# Altium schematic sheet Startracker_Power.SchDoc
size A3; SheetNumber: 2; SheetTotal: 3
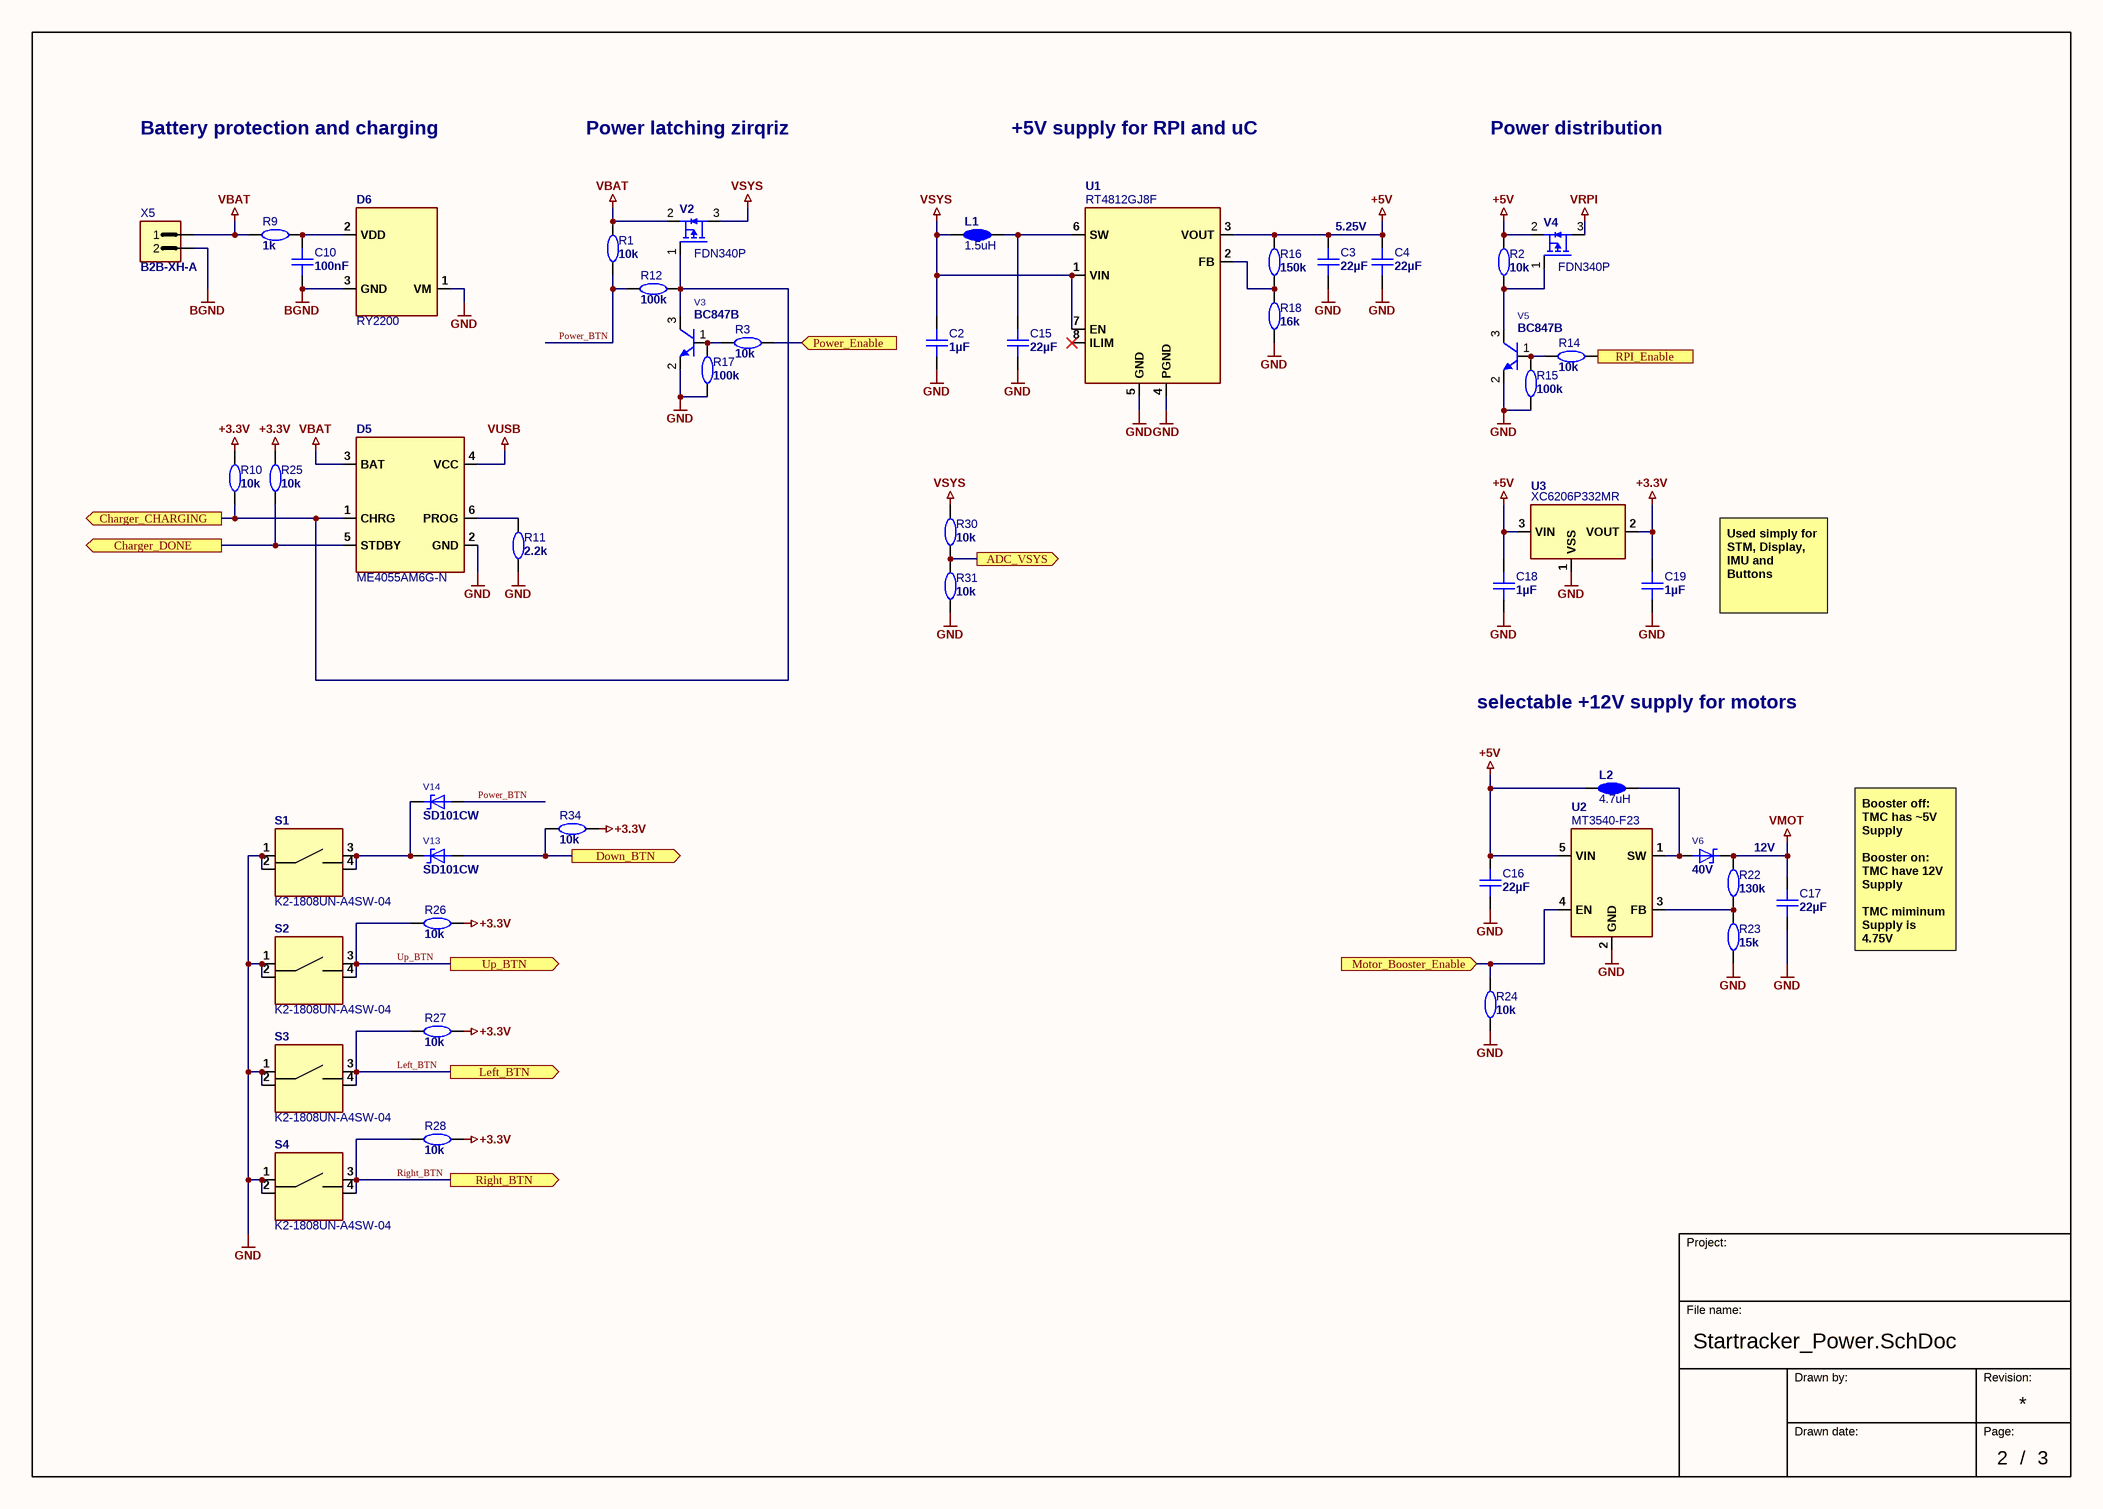
[diagram p0: Startracker_Power.SchDoc]

## Parts
C2  value 1µF  [C-0603_1608_095_L_RF]  (hidden comment: Cap 1u 0603)
C3  value 22µF  [C-1206_3216_230_L_RF]  (hidden comment: Cap 22u 25V 10% 1206)
C4  value 22µF  [C-1206_3216_230_L_RF]  (hidden comment: Cap 22u 25V 10% 1206)
C10  value 100nF  [C-0603_1608_095_L_RF]  (hidden comment: Cap 100n 0603)
C15  value 22µF  [C-1206_3216_230_L_RF]  (hidden comment: Cap 22u 25V 10% 1206)
C16  value 22µF  [C-1206_3216_230_L_RF]  (hidden comment: Cap 22u 25V 10% 1206)
C17  value 22µF  [C-1206_3216_230_L_RF]  (hidden comment: Cap 22u 25V 10% 1206)
C18  value 1µF  [C-0603_1608_095_L_RF]  (hidden comment: Cap 1u 0603)
C19  value 1µF  [C-0603_1608_095_L_RF]  (hidden comment: Cap 1u 0603)
D5  ME4055AM6G-N  [SOT23-6_N_RF]
D6  RY2200  [SOT23_N_RF]
L1  1.5uH  [L-0490X0490_N_RF]
L2  4.7uH  [L-0400X0400_N_RF]
R1  value 10k  [R-0603_1608_050_L_RF]  (hidden comment: Res 10k 0603)
R2  value 10k  [R-0603_1608_050_L_RF]  (hidden comment: Res 10k 0603)
R3  value 10k  [R-0603_1608_050_L_RF]  (hidden comment: Res 10k 0603)
R9  value 1k  [R-0603_1608_050_L_RF]  (hidden comment: Res 1k 0603)
R10  value 10k  [R-0603_1608_050_L_RF]  (hidden comment: Res 10k 0603)
R11  value 2.2k  [R-0603_1608_050_L_RF]  (hidden comment: Res 2k2 0603)
R12  value 100k  [R-0603_1608_050_L_RF]  (hidden comment: Res 100k 0603)
R14  value 10k  [R-0603_1608_050_L_RF]  (hidden comment: Res 10k 0603)
R15  value 100k  [R-0603_1608_050_L_RF]  (hidden comment: Res 100k 0603)
R16  value 150k  [R-0603_1608_050_L_RF]  (hidden comment: Res 150k 0603)
R17  value 100k  [R-0603_1608_050_L_RF]  (hidden comment: Res 100k 0603)
R18  value 16k  [R-0603_1608_050_L_RF]  (hidden comment: Res 16k 0603)
R22  value 130k  [R-0603_1608_050_L_RF]  (hidden comment: Res 130k 0603)
R23  value 15k  [R-0603_1608_050_L_RF]  (hidden comment: Res 15k 0603)
R24  value 10k  [R-0603_1608_050_L_RF]  (hidden comment: Res 10k 0603)
R25  value 10k  [R-0603_1608_050_L_RF]  (hidden comment: Res 10k 0603)
R26  value 10k  [R-0603_1608_050_L_RF]  (hidden comment: Res 10k 0603)
R27  value 10k  [R-0603_1608_050_L_RF]  (hidden comment: Res 10k 0603)
R28  value 10k  [R-0603_1608_050_L_RF]  (hidden comment: Res 10k 0603)
R30  value 10k  [R-0603_1608_050_L_RF]  (hidden comment: Res 10k 0603)
R31  value 10k  [R-0603_1608_050_L_RF]  (hidden comment: Res 10k 0603)
R34  value 10k  [R-0603_1608_050_L_RF]  (hidden comment: Res 10k 0603)
S1  K2-1808UN-A4SW-04  [K2-1808UN-A4SW-04]
S2  K2-1808UN-A4SW-04  [K2-1808UN-A4SW-04]
S3  K2-1808UN-A4SW-04  [K2-1808UN-A4SW-04]
S4  K2-1808UN-A4SW-04  [K2-1808UN-A4SW-04]
U1  RT4812GJ8F  [TSOT-23-8]
U2  MT3540-F23  [SOT23-5_N_RF]
U3  XC6206P332MR  [SOT23_N_RF]
V2  FDN340P  [SOT23_N_RF]
V3  BC847B  [SOT23_L_RF]
V4  FDN340P  [SOT23_N_RF]
V5  BC847B  [SOT23_L_RF]
V6  value 40V  [SMA_DO214AC_L_RF]  (hidden comment: SS14-E3)
V13  value SD101CW  [SOD123_L_RF]  (hidden comment: SD101CW-E3-08)
V14  value SD101CW  [SOD123_L_RF]  (hidden comment: SD101CW-E3-08)
X5  value B2B-XH-A  [X-0074X0057-R_M02_P0250_JST_B2B-XH-A]  (hidden comment: CONN HEADER XH 2POS THT)

## Ports
ADC_VSYS (out), Charger_CHARGING (out), Charger_DONE (out), Down_BTN (out), Left_BTN (out), Motor_Booster_Enable (in), Power_Enable (in), Right_BTN (out), RPI_Enable (in), Up_BTN (out)

## Nets
+3.3V: C19.2 R10.2 R25.2 R26.2 R27.2 R28.2 R34.2 U3.2(VOUT)
+5V: C3.2 C4.2 C16.2 C18.2 L2.1 R2.2 R16.2 U1.3(VOUT) U2.5(VIN) U3.3(VIN) V4.2(S)
BGND: C10.1 D6.3(GND) X5.2
GND: C2.1 C3.1 C4.1 C15.1 C16.1 C17.1 C18.1 C19.1 D5.2(GND) D6.1(VM) R11.1 R15.1 R17.1 R18.1 R23.1 R24.2 R31.1 S1.1 S1.2 S2.1 S2.2 S3.1 S3.2 S4.1 S4.2 U1.4(PGND) U1.5(GND) U2.2(GND) U3.1(VSS) V3.2(E) V5.2(E)
VBAT: D5.3(BAT) R1.2 R9.1 V2.2(S) X5.1
VMOT: C17.2 R22.2 V6.2
VRPI: V4.3(D)
VSYS: C2.2 L1.1 R30.2 U1.1(VIN) U1.7(EN) V2.3(D)
VUSB: D5.4(VCC)
ADC_VSYS: R30.1 R31.2 ; port ADC_VSYS
Charger_CHARGING: D5.1(CHRG) R10.1 R12.1 V2.1(G) V3.3(C) ; port Charger_CHARGING
Charger_DONE: D5.5(STDBY) R25.1 ; port Charger_DONE
Down_BTN: R34.1 V13.1 ; port Down_BTN
Left_BTN: R27.1 S3.3 S3.4 ; port Left_BTN
Motor_Booster_Enable: R24.1 U2.4(EN) ; port Motor_Booster_Enable
Power_BTN: R1.1 R12.2 V14.1
Power_Enable: R3.2 ; port Power_Enable
Right_BTN: R28.1 S4.3 S4.4 ; port Right_BTN
RPI_Enable: R14.2 ; port RPI_Enable
Up_BTN: R26.1 S2.3 S2.4 ; port Up_BTN
NetC10_2: C10.2 D6.2(VDD) R9.2
NetC15_2: C15.2 L1.2 U1.6(SW)
NetD5_6: D5.6(PROG) R11.2
NetL2_2: L2.2 U2.1(SW) V6.1
NetR2_1: R2.1 V4.1(G) V5.3(C)
NetR3_1: R3.1 R17.2 V3.1(B)
NetR14_1: R14.1 R15.2 V5.1(B)
NetR16_1: R16.1 R18.2 U1.2(FB)
NetR22_1: R22.1 R23.2 U2.3(FB)
NetS1_3: S1.3 S1.4 V13.2 V14.2

Not connected (* = marked no-connect by the designer): U1 8(ILIM)*

## Notes on the sheet
- Battery protection and charging
- Power latching zirqriz
- +5V supply for RPI and uC
- Power distribution
- 5.25V
- Used simply for STM, Display, IMU and Buttons
- selectable +12V supply for motors
- 12V
- Booster off:
  TMC has ~5V Supply
  Booster on:
  TMC have 12V Supply
  TMC miminum Supply is 4.75V
- Project:
- File name:
- Drawn by:
- Revision:
- Drawn date:
- Page:
- /

## Library data of the parts
C2 C18 C19 = CMP-001-0045-2: Cap Cer SMD 1u 16V 10% 0603 X7R; Manufacturer Part Number: 0603YC105KAT*; Manufacturer: AVX; Prefered: true; User: zupa; GPV_Number: 1749.0125; MNL_Number: 22310613; ComponentLink1Description: Datasheet; ClassName: Surface_Assy; PartStatus: Release; Case / Package: 0603; ComponentLink1URL: https://datasheet.ciiva.com/11464/ccog-11464569.pdf; Technology: SMT
C3 C4 C15 C16 = CMP-001-0137-2: Cap Cer SMD 22u 25V 10% 1206 X5R; Manufacturer Part Number: GRM31CR61E226KE15*; Manufacturer: MURATA; Prefered: false; GPV_Number: 1751.0116; User: zupa; PartStatus: Release; Technology: SMT; ComponentLink1Description: Datasheet; ComponentLink1URL: https://datasheet.ciiva.com/3778/100grm31cr61e226ke1523-3778430.pdf; ClassName: Surface_Assy; Case / Package: 1206
C10 = CMP-001-0037-3: Cap Cer SMD 100n 50V 10% 0603 X7R; Manufacturer: KEMET; Manufacturer Part Number: C0603C104K5RAC; User: epph; Prefered: true; MNL_Number: 22310507; GPV_Number: 1749.0075; Case / Package: 0603; PartStatus: Release; Technology: SMT; ClassName: Surface_Assy
C17 = CMP-001-0137-2: Cap Cer SMD 22u 25V 10% 1206 X5R; Manufacturer: MURATA; Manufacturer Part Number: GRM31CR61E226KE15*; User: zupa; GPV_Number: 1751.0116; Prefered: false; Technology: SMT; PartStatus: Release; ComponentLink1Description: Datasheet; ComponentLink1URL: https://datasheet.ciiva.com/3778/100grm31cr61e226ke1523-3778430.pdf; Case / Package: 1206; ClassName: Surface_Assy
D5 = ME4055AM6G-N: IC Charger Li-Ion 1Cell; Part_validated: No; Manufacturer: MICRONE; GPV_Number: xxxx.xxxx; MNL_Number: xxxxxxxx; Value: ME4055AM6G-N; Footprint_validated: No; PartStatus: New; System: -; ClassName: Surface_Assy; Case/Package: SOT-23-6; Technology: SMT; Manufacturer Part Number: ME4055AM6G-N
D6 = RY2200: IC Protection Li-Ion; Part_validated: No; Manufacturer: Rychip; GPV_Number: xxxx.xxxx; MNL_Number: xxxxxxxx; Value: RY2200; Footprint_validated: No; PartStatus: New; System: -; Case/Package: SOT23; Technology: SMT; Manufacturer Part Number: RY2200; ClassName: Surface_Assy
L1 = NRS5040T1R5NMGJ: IND 4.7uH 6.4A 4.9x4.9mm; Part_validated: No; Manufacturer: TAIYO YUDEN; GPV_Number: xxxx.xxxx; MNL_Number: xxxxxxxx; Value: 1.5uH; Footprint_validated: No; PartStatus: New; System: -; ClassName: Surface_Assy; Case/Package: 4.9x4.9; Technology: SMT; Manufacturer Part Number: NRS5040T1R5NMGJ
L2 = APSWPA4030S4R7MTF: IND 4.7uH 2.9A 4x4mm; Part_validated: No; Manufacturer: APV; GPV_Number: xxxx.xxxx; MNL_Number: xxxxxxxx; Value: 4.7uH; Footprint_validated: No; PartStatus: New; System: -; ClassName: Surface_Assy; Case/Package: 4x4; Technology: SMT; Manufacturer Part Number: APSWPA4030S4R7MTF
R1-R3 R10 R14 R24-R28 R30 R31 R34 = CMP-001-0241-3: Res SMD 10k 1% 0.1W 0603; Manufacturer: YAGEO; Manufacturer Part Number: RC0603FR-0710KL; MNL_Number: 15310022; GPV_Number: 1922.0100; User: zupa; Prefered: true; Case / Package: 0603; ClassName: Surface_Assy; PartStatus: Release; ComponentLink1URL: https://datasheet.ciiva.com/11808/0900766b80f96399-11808280.pdf; ComponentLink1Description: Datasheet; Technology: SMT
R9 = CMP-001-0250-3: Res SMD 1k 1% 0.1W 0603; Manufacturer: YAGEO; Manufacturer Part Number: RC0603FR-071KL; MNL_Number: 15310012; User: zupa; GPV_Number: 1922.0011; Prefered: true; Technology: SMT; ComponentLink1Description: Datasheet; ClassName: Surface_Assy; ComponentLink1URL: https://datasheet.ciiva.com/11808/0900766b80f96399-11808280.pdf; Case / Package: 0603; PartStatus: Release
R11 = CMP-001-0261-3: Res SMD 2k2 1% 0.1W 0603; Manufacturer: YAGEO; Manufacturer Part Number: RC0603FR-072K2L; Prefered: true; User: zupa; GPV_Number: 1922.1472; ClassName: Surface_Assy; ComponentLink1Description: Datasheet; PartStatus: Release; ComponentLink1URL: https://datasheet.ciiva.com/11808/0900766b80f96399-11808280.pdf; Case / Package: 0603; Technology: SMT
R12 R15 R17 = CMP-001-0607-3: Res SMD 100k 1% 0.1W 0603; Manufacturer: YAGEO; Manufacturer Part Number: RC0603FR-07100KL; User: napa; GPV_Number: 1922.0140; MNL_Number: 15310632; Prefered: true; ComponentLink1Description: Datasheet; Technology: SMT; PartStatus: Release; ComponentLink1URL: https://datasheet.ciiva.com/8895/pyu-rc0603-51-rohs-l-4-8895189.pdf; ClassName: Surface_Assy; Case / Package: 0603
R16 = CMP-001-0611-3: Res SMD 150k 1% 0.1W 0603; Manufacturer: YAGEO; Manufacturer Part Number: RC0603FR-07150KL; GPV_Number: 1922.1023; Prefered: true; User: napa; ClassName: Surface_Assy; PartStatus: Release; ComponentLink1Description: Datasheet; Case / Package: 0603; Technology: SMT; ComponentLink1URL: https://datasheet.ciiva.com/8895/pyu-rc0603-51-rohs-l-4-8895189.pdf
R18 = CMP-001-0592-3: Res SMD 16k 1% 0.1W 0603; Manufacturer: YAGEO; Manufacturer Part Number: RC0603FR-0716KL; User: napa; Prefered: true; GPV_Number: 1922.0079; Technology: SMT; ClassName: Surface_Assy; PartStatus: Release; ComponentLink1URL: https://datasheet.ciiva.com/8895/pyu-rc0603-51-rohs-l-4-8895189.pdf; ComponentLink1Description: Datasheet; Case / Package: 0603
R22 = CMP-001-0610-3: Res SMD 130k 1% 0.1W 0603; Manufacturer Part Number: RT0603FRE07130KL; Manufacturer: YAGEO; GPV_Number: 1922.0505; User: napa; Prefered: true; Technology: SMT; PartStatus: Release; ClassName: Surface_Assy; ComponentLink1Description: Datasheet; ComponentLink1URL: https://datasheet.ciiva.com/7746/1392914-7746698.pdf; Case / Package: 0603
R23 = CMP-001-0247-3: Res SMD 15k 1% 0.1W 0603; Manufacturer: YAGEO; Manufacturer Part Number: RC0603FR-0715KL; GPV_Number: 1922.0034; Prefered: true; User: zupa; PartStatus: Release; ComponentLink1URL: https://datasheet.ciiva.com/11808/0900766b80f96399-11808280.pdf; ComponentLink1Description: Datasheet; Technology: SMT; Case / Package: 0603; ClassName: Surface_Assy
S1-S4 = K2-1808UN-A4SW-04: BUTTON tactile 12V 50mA; Part_validated: No; Manufacturer: HROparts; GPV_Number: xxxx.xxxx; MNL_Number: xxxxxxxx; Value: K2-1808UN-A4SW-04; Footprint_validated: No; PartStatus: New; System: -; ClassName: Surface_Assy; Case/Package: 4pin; Technology: SMT; Manufacturer Part Number: K2-1808UN-A4SW-04
U1 = RT4812GJ8F: IC Boost Converter 1.8V-5.5V to 1.8-5.5V 2.1A; Part_validated: No; Manufacturer: Richtek; GPV_Number: xxxx.xxxx; MNL_Number: xxxxxxxx; Value: RT4812GJ8F; Footprint_validated: No; PartStatus: New; System: -; ClassName: Surface_Assy; Case/Package: TSOT-23-8; Technology: SMT; Manufacturer Part Number: RT4812GJ8F
U2 = MT3540-F23: IC Boost Converter 2.5V-5.5V upto 28V 1.5A; Part_validated: No; Manufacturer: Aerosemi; GPV_Number: xxxx.xxxx; MNL_Number: xxxxxxxx; Value: MT3540-F23; Footprint_validated: No; PartStatus: New; System: -; ClassName: Surface_Assy; Case/Package: SOT23-5; Technology: SMT; Manufacturer Part Number: MT3540-F23
U3 = XC6206P332MR: IC REG LDO 3.3V 200mA; Part_validated: No; Manufacturer: Torex; GPV_Number: xxxx.xxxx; MNL_Number: xxxxxxxx; Value: XC6206P332MR; Footprint_validated: No; PartStatus: New; System: -; ClassName: Surface_Assy; Case/Package: SOT23; Technology: SMT; Manufacturer Part Number: XC6206P332MR
V2 V4 = FDN340P: MOSFET PCH -2A 20V; Part_validated: No; Manufacturer: onsemi; GPV_Number: xxxx.xxxx; MNL_Number: xxxxxxxx; Value: FDN340P; Footprint_validated: No; PartStatus: New; System: -; ClassName: Surface_Assy; Case/Package: SOT-23; Technology: SMT; Manufacturer Part Number: FDN340P
V3 V5 = CMP-001-1243-2: TRANS SMD NPN 45V 0.1A BC847B SOT23; Manufacturer: NXP Semiconductors; Manufacturer Part Number: BC847B/C; User: zupa; GPV_Number: 1601.0512; MNL_Number: 48470200; ClassName: Surface_Assy; Value: BC847B; Technology: SMT; Case / Package: SOT23; PartStatus: Release
V6 = CMP-00074-1: Diode Schottky 40V 1A SMA; Manufacturer: VISHAY; GPV_Number: 1600.1206; User: epph; PartStatus: New; Technology: SMT; Manufacturer Part Number: SS14-E3; ClassName: Surface_Assy; Case / Package: SMA
V13 V14 = CMP-001-1356-2: Diode Schottky  1mA 40 Volt; Manufacturer: VISHAY; User: zupa; Manufacturer Part Number: SD101CW-E3-08; ComponentLink1Description: Datasheet; Case / Package: SOD123; ClassName: Surface_Assy; ComponentLink1URL: https://www.vishay.com/docs/85679/sd101aw.pdf; Technology: SMT; PartStatus: Release
X5 = CMP-00140-3: CONN HEADER  2POS_JST_B2B-XH; Manufacturer: JST; GPV_Number: 4401.1025; User: balu; System: Connector; Manufacturer Part Number: B2B-XH-A; PartStatus: Release; Technology: THT; ClassName: Through-Hole_Assy